# EAGLE design USBBreakout-ISO-3.2 (EAGLE 9.6.2)
Assembly variants: JLCPCB

## Sheet 1 of 3
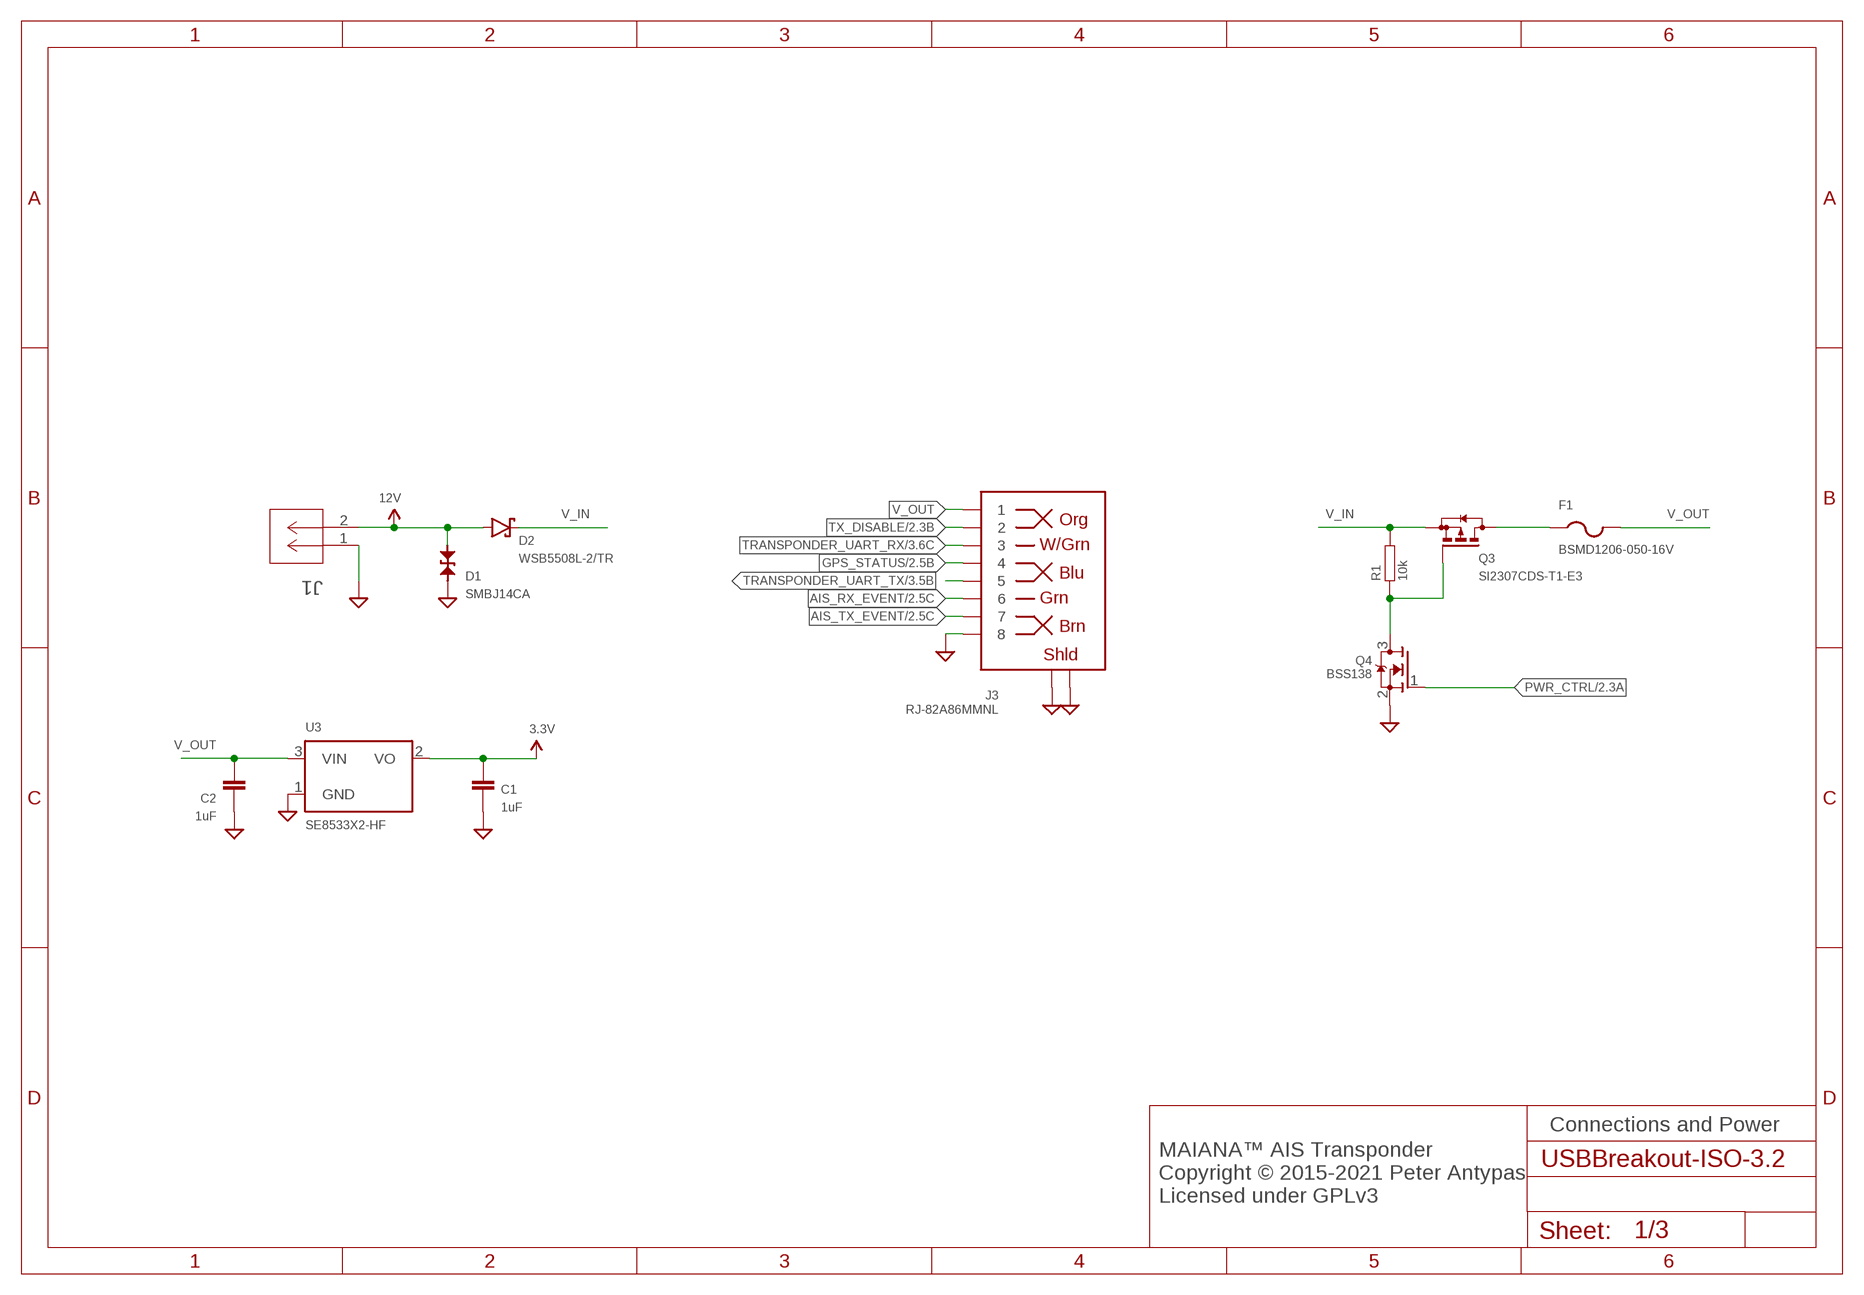
[diagram p0: schematic, sheet 1]

### Parts
C1  1uF  CAPACITOR0603  [0603]
C2  1uF  CAPACITOR0603  [0603]
D1  SMBJ14CA  DIODE-TVS-BIDIRSMB  [SMB-BIDIR]
D2  WSB5508L-2/TR  DIODE-SCHOTTKYSOD123  [SOD123]
F1  BSMD1206-050-16V  PTCFUSE-1206  [R1206]
J1  OSTVN02A150  [CONN_OSTVN02A150_OST]  (not fitted in variant JLCPCB)
J3  RJ-82A86MMNL  [RJ-82A86MMNL]
Q3  SI2307CDS-T1-E3  BSS84  [SOT23]
Q4  BSS138  MOSFET-NREFLOW  [SOT23]
R1  10k  RESISTOR0603  [0603]
U3  SE8533X2-HF  MCP1799T  [SOT23]

### Nets
3.3V: C1.P$1 U3.2(VO) ; also sheet 2,3
12V: D1.A D2.A J1.2
AIS_RX_EVENT: J3.P$6 ; also sheet 2
AIS_TX_EVENT: J3.P$7 ; also sheet 2
GND: C1.P$2 C2.P$2 D1.C J1.1 J3.P$8 J3.P$9(SHLD) J3.P$10(SHLD) J3.P$11(SHLD) J3.P$12(SHLD) Q4.2(S) U3.1(GND) ; also sheet 2,3
GPS_STATUS: J3.P$4 ; also sheet 2
N$8: Q3.1(G) Q4.3(D) R1.P$1
N$10: F1.1 Q3.3(D)
PWR_CTRL: Q4.1(G) ; also sheet 2
TRANSPONDER_UART_RX: J3.P$3 ; also sheet 3
TRANSPONDER_UART_TX: J3.P$5 ; also sheet 3
TX_DISABLE: J3.P$2 ; also sheet 2
V_IN: D2.C Q3.2(S) R1.P$2 ; also sheet 2
V_OUT: C2.P$1 F1.2 J3.P$1 U3.3(VIN)

### Notes on the sheet
- Connections and Power
- MAIANA™ AIS Transponder
  Copyright © 2015-2021 Peter Antypas
  Licensed under GPLv3

## Sheet 2 of 3
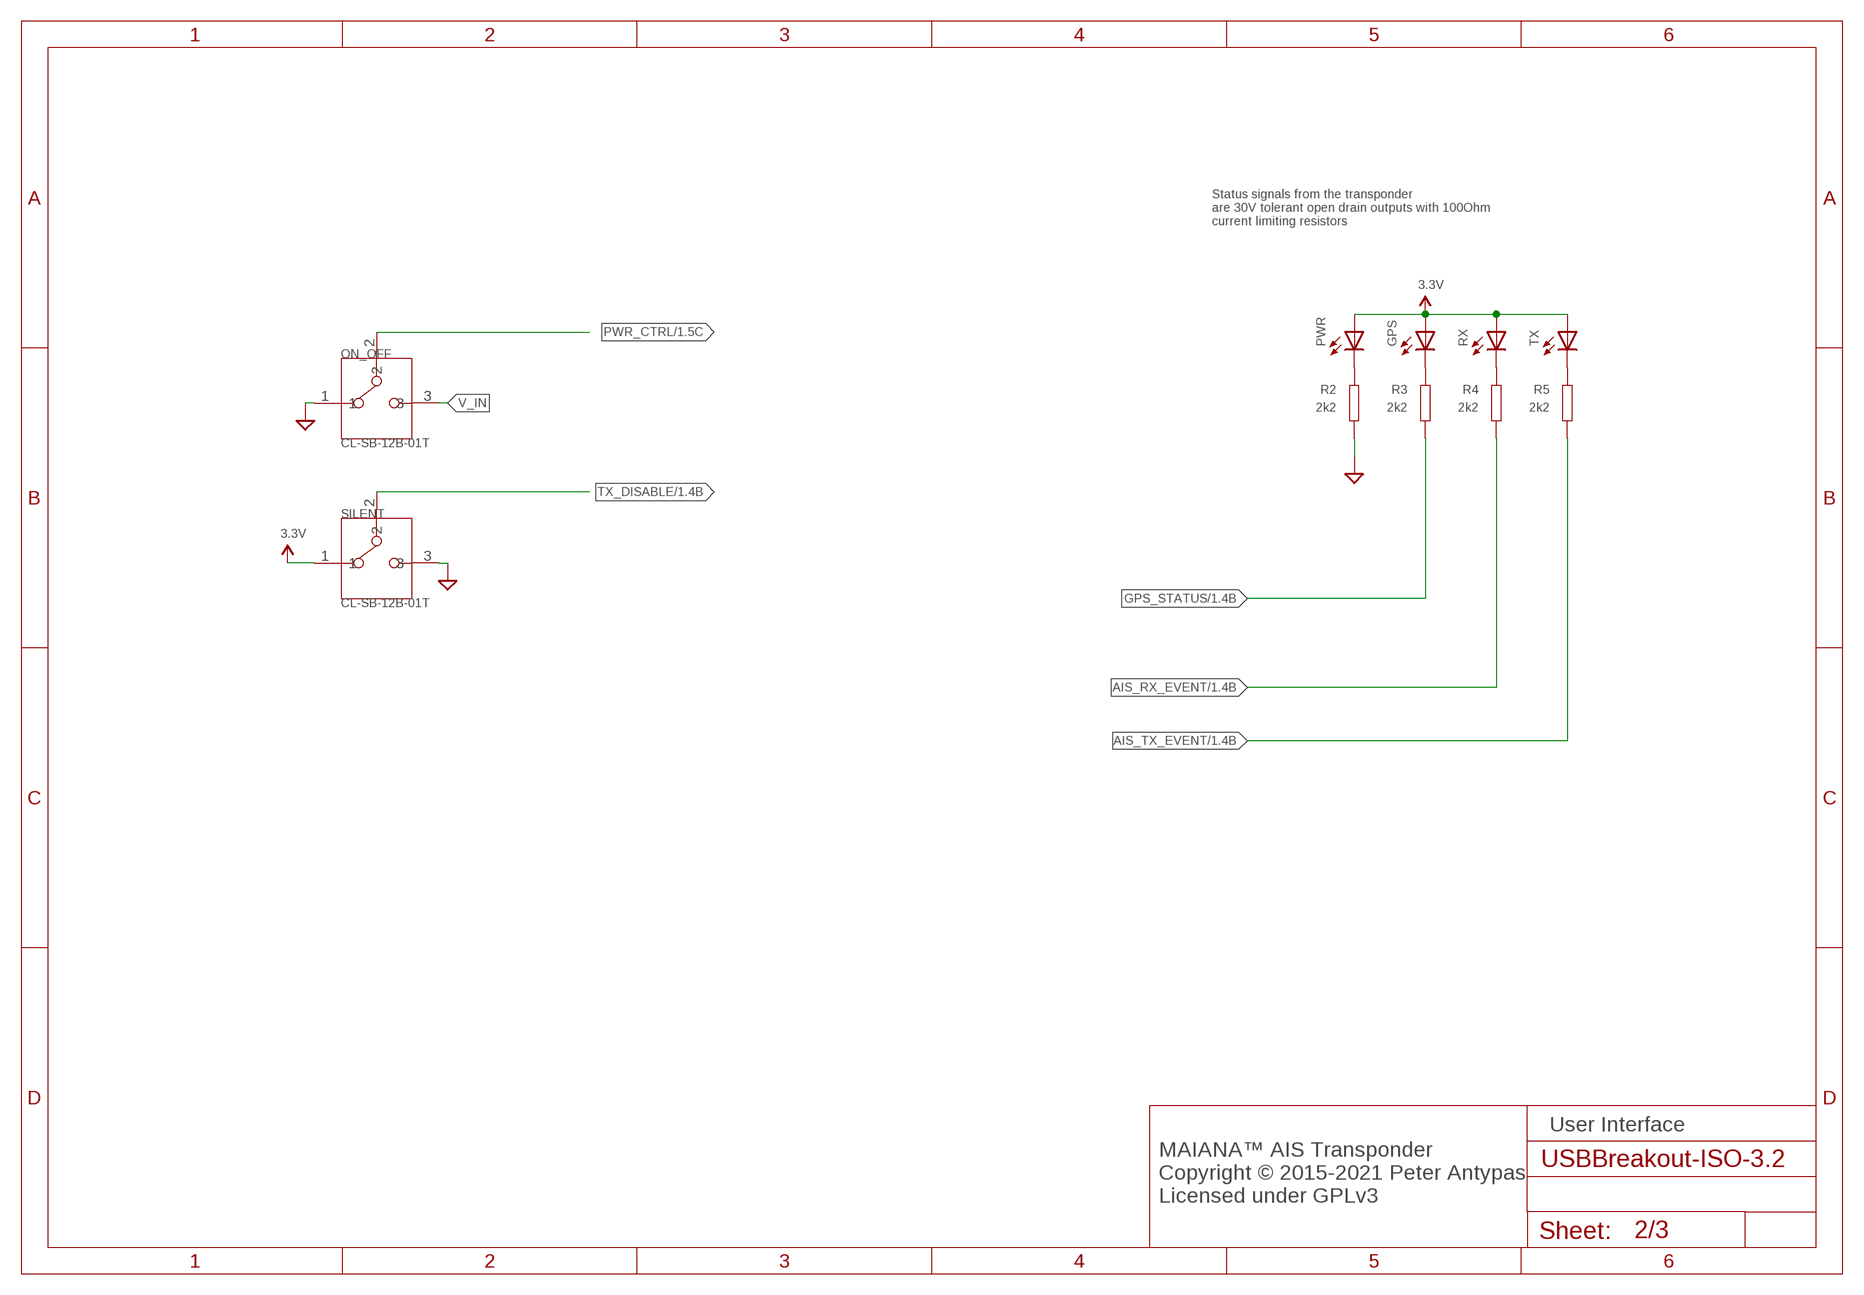
[diagram p1: schematic, sheet 2]

### Parts
GPS  LEDCHIPLED_1206  [CHIPLED_1206]
ON_OFF  CL-SB-12B-01T  [CL-SB-12B]
PWR  LEDCHIPLED_1206  [CHIPLED_1206]
R2  2k2  RESISTOR0603  [0603]
R3  2k2  RESISTOR0603  [0603]
R4  2k2  RESISTOR0603  [0603]
R5  2k2  RESISTOR0603  [0603]
RX  LEDCHIPLED_1206  [CHIPLED_1206]
SILENT  CL-SB-12B-01T  [CL-SB-12B]
TX  LEDCHIPLED_1206  [CHIPLED_1206]

### Nets
3.3V: GPS.A PWR.A RX.A SILENT.1 TX.A ; also sheet 1,3
AIS_RX_EVENT: R4.P$2 ; also sheet 1
AIS_TX_EVENT: R5.P$2 ; also sheet 1
GND: ON_OFF.1 R2.P$2 SILENT.3 ; also sheet 1,3
GPS_STATUS: R3.P$2 ; also sheet 1
N$2: PWR.C R2.P$1
N$3: GPS.C R3.P$1
N$4: R4.P$1 RX.C
N$5: R5.P$1 TX.C
PWR_CTRL: ON_OFF.2 ; also sheet 1
TX_DISABLE: SILENT.2 ; also sheet 1
V_IN: ON_OFF.3 ; also sheet 1

### Notes on the sheet
- Status signals from the transponder
  are 30V tolerant open drain outputs with 100Ohm 
  current limiting resistors
- User Interface
- MAIANA™ AIS Transponder
  Copyright © 2015-2021 Peter Antypas
  Licensed under GPLv3

## Sheet 3 of 3
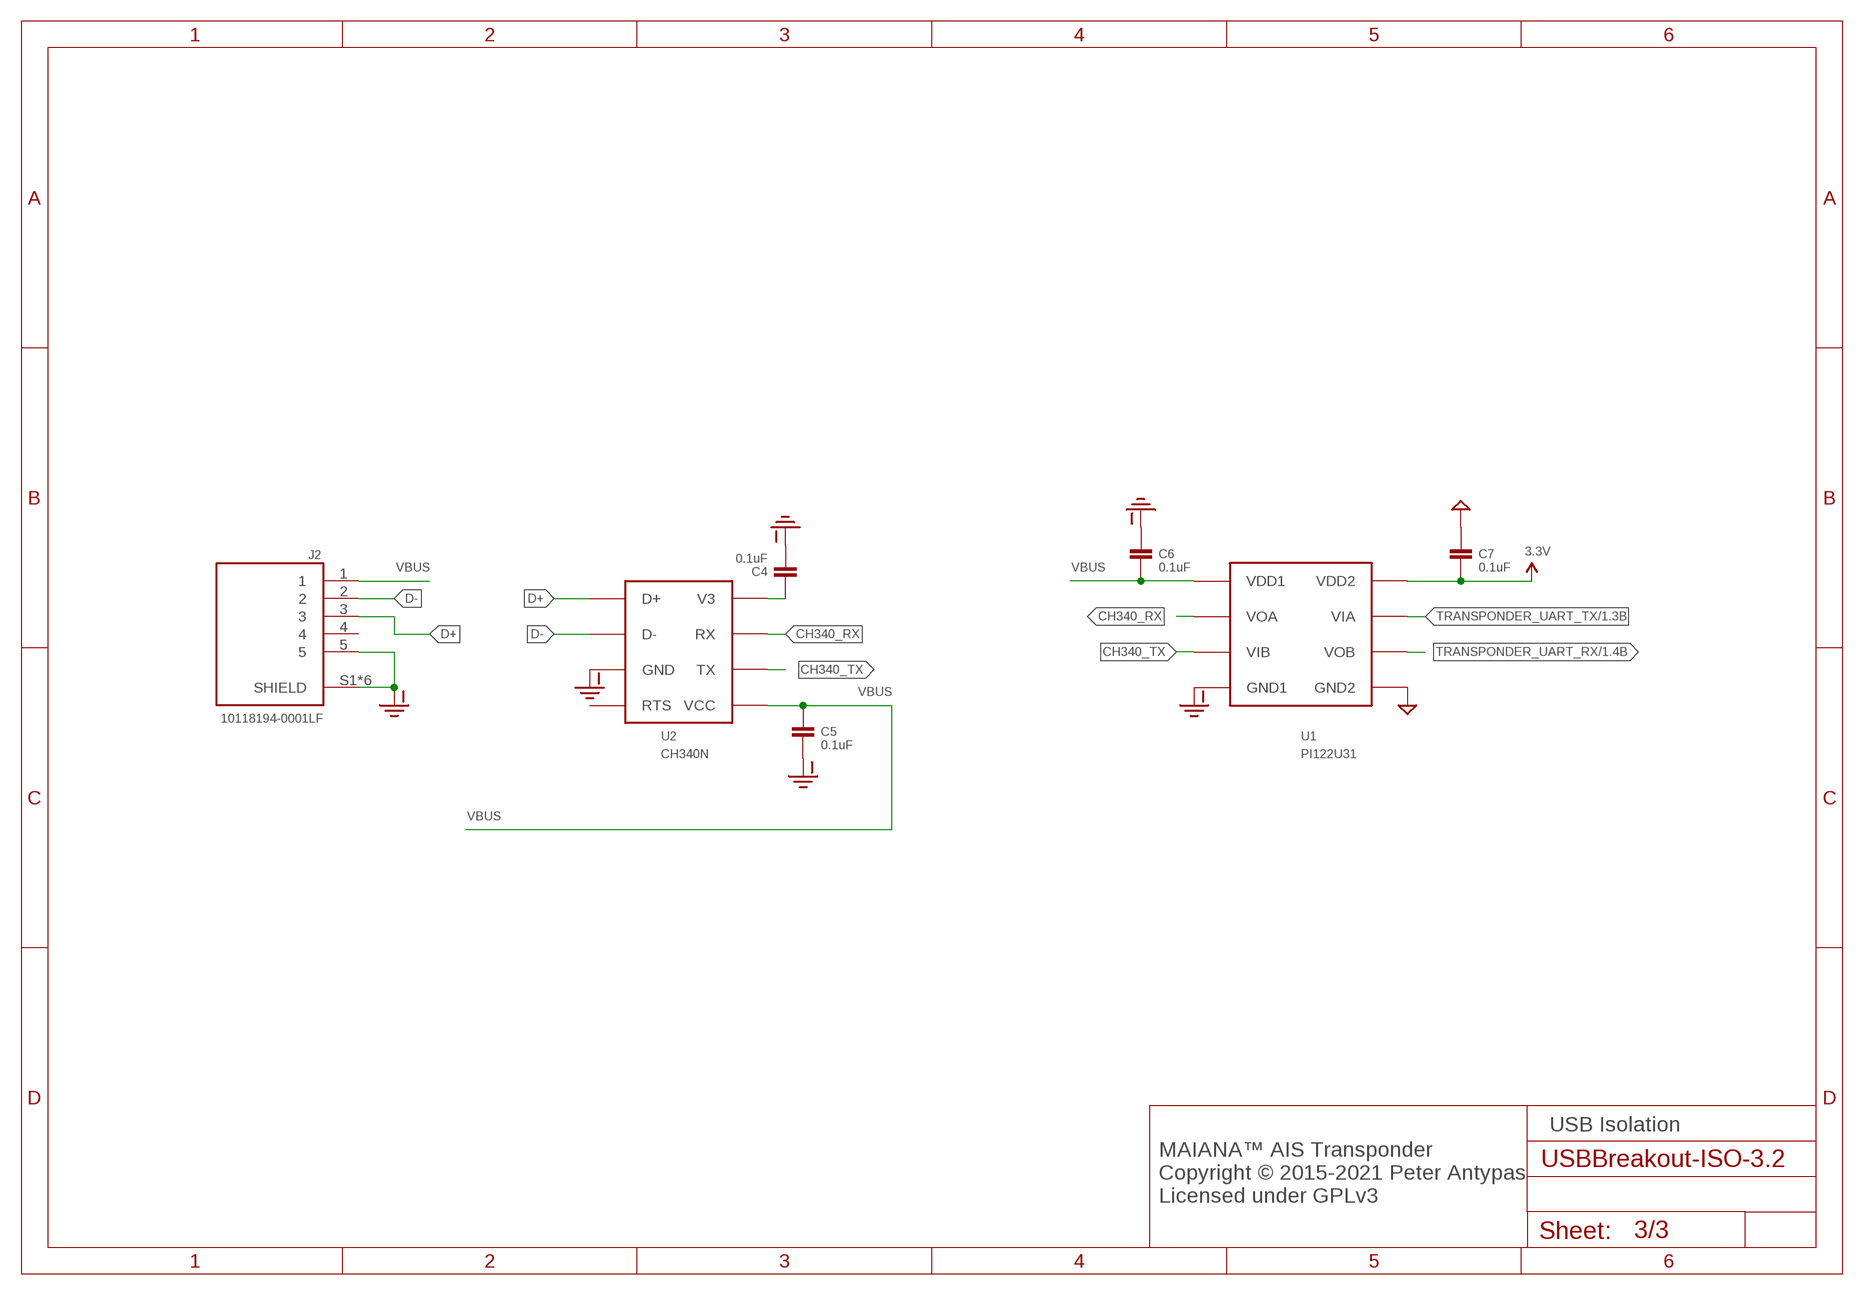
[diagram p2: schematic, sheet 3]

### Parts
C4  0.1uF  CAPACITOR0603  [0603]
C5  0.1uF  CAPACITOR0603  [0603]
C6  0.1uF  CAPACITOR0603  [0603]
C7  0.1uF  CAPACITOR0603  [0603]
J2  10118194-0001LF  [AMPHENOL_10118194-0001LF]
U1  PI122U31  PI122U3X  [SOIC8]
U2  CH340N  CH330N  [SOIC-8]

### Nets
3.3V: C7.P$2 U1.8(VDD2) ; also sheet 1,2
CH340_RX: U1.2(VOA) U2.7(RX)
CH340_TX: U1.3(VIB) U2.6(TX)
D+: J2.3 U2.1(D+)
D-: J2.2 U2.2(D-)
GND: C7.P$1 U1.5(GND2) ; also sheet 1,2
GND-ISO: C4.P$2 C5.P$2 C6.P$1 J2.5 J2.S1(SHIELD) J2.S2(SHIELD) J2.S3(SHIELD) J2.S4(SHIELD) J2.S5(SHIELD) J2.S6(SHIELD) U1.4(GND1) U2.3(GND)
N$1: C4.P$1 U2.8(V3)
TRANSPONDER_UART_RX: U1.6(VOB) ; also sheet 1
TRANSPONDER_UART_TX: U1.7(VIA) ; also sheet 1
VBUS: C5.P$1 C6.P$2 J2.1 U1.1(VDD1) U2.5(VCC)
Unconnected: J2.4 U2.4(RTS)

### Notes on the sheet
- USB Isolation
- MAIANA™ AIS Transponder
  Copyright © 2015-2021 Peter Antypas
  Licensed under GPLv3

## Library data of the parts
C1 C2 = MyPassives:CAPACITOR: Standard SMD capacitor; PARTNO: CC0603KRX5R8BB105
C4-C7 = MyPassives:CAPACITOR: Standard SMD capacitor; PARTNO: 06035C104KAT2A
D1 = MyDiodes:DIODE-TVS-BIDIR: Bidirectional TVS diode; PARTNO: SMBJ14CA
D2 = MyDiodes:DIODE-SCHOTTKY: Standard SMD Schottky diode; PARTNO: WSB5508L-2/TR
F1 = adafruit:PTCFUSE: PTC fuses, resettable thermistors; PARTNO: BSMD1206-050-16V
GPS PWR RX TX = led:LED: LED OSRAM: - CHIPLED LG R971, LG N971, LY N971, LG Q971, LY Q971, LO R971, LY R971 LH N974, LH R974 LS Q976, LO Q976, LY Q976 LO Q996 - Hyper CHIPLED LW Q18S LB Q993, LB Q99A, LB R99A - SideLED LS A670, LO A670, LY A670, LG A670, LP A670 LB A673, LV A673, LT A673, LW A673 LH A674 LY A675 LS A676, LA A676, LO A676, LY A676, LW A676 LS A679, LY A679, LG A679 - Hyper Micro SIDELED® LS Y876, LA Y876, LO Y876, LY Y876 LT Y87S - SmartLED LW L88C, LW L88S LB L89C, LB L89S, LG L890 LS L89K, LO L89K, LY L89K LS L896, LA L896, LO L896, LY L896 - TOPLED LS T670, LO T670, LY T670, LG T670, LP T670 LSG T670, LSP T670, LSY T670, LOP T670, LYG T670 LG T671, LOG T671, LSG T671 LB T673, LV T673, LT T673, LW T673 LH T674 LS T676, LA T676, LO T676, LY T676, LB T676, LH T676, LSB T676, LW T676 LB T67C, LV T67C, LT T67C, LS T67K, LO T67K, LY T67K, LW E67C LS E67B, LA E67B, LO E67B, LY E67B, LB E67C, LV E67C, LT E67C LW T67C LS T679, LY T679, LG T679 LS T770, LO T770, LY T770, LG T770, LP T770 LB T773, LV T773, LT T773, LW T773 LH T774 LS E675, LA E675, LY E675, LS T675 LS T776, LA T776, LO T776, LY T776, LB T776 LHGB T686 LT T68C, LB T68C - Hyper Mini TOPLED® LB M676 - Mini TOPLED Santana® LG M470 LS M47K, LO M47K, LY M47K Source: http://www.osram.convergy.de LUXEON: - LUMILED® LXK2-PW12-R00, LXK2-PW12-S00, LXK2-PW14-U00, LXK2-PW14-V00 LXK2-PM12-R00, LXK2-PM12-S00, LXK2-PM14-U00 LXK2-PE12-Q00, LXK2-PE12-R00, LXK2-PE12-S00, LXK2-PE14-T00, LXK2-PE14-U00 LXK2-PB12-K00, LXK2-PB12-L00, LXK2-PB12-M00, LXK2-PB14-N00, LXK2-PB14-P00, LXK2-PB14-Q00 LXK2-PR12-L00, LXK2-PR12-M00, LXK2-PR14-Q00, LXK2-PR14-R00 LXK2-PD12-Q00, LXK2-PD12-R00, LXK2-PD12-S00 LXK2-PH12-R00, LXK2-PH12-S00 LXK2-PL12-P00, LXK2-PL12-Q00, LXK2-PL12-R00 Source: www.luxeon.com KINGBRIGHT: KA-3528ASYC Source: www.kingbright.com; PARTNO: TJ-S3216CL9T5ALC2G-A5
J1 = ost-2pin-contact:OSTVN02A150; BUILT_BY: EMA_Cory; COPYRIGHT: Copyright (C) 2018 Accelerated Designs. All rights reserved; MANUFACTURER_PART_NUMBER: OSTVN02A150; PARTNO: OSTVN02A150; SOURCELIBRARY: On_Shore_Technology_2019-12-02; VENDOR: On Shore Technology Inc
J2 = 10118194-0001LF:10118194-0001LF: Micro Usb, 2.0 Type b, Rcpt, Smt Check prices <https://snapeda.com/parts/10118194-0001LF/Amphenol%20ICC%20%28FCI%29/view-part/?ref=eda>; ARROW_ELECTRONICS-PURCHASE-URL: https://snapeda.com/shop?store=Arrow+Electronics&id=4816633; AVAILABILITY: Good; DESCRIPTION: USB - micro B USB 2.0 Receptacle Connector 5 Position Surface Mount, Right Angle; Through Hole; DIGIKEY-PURCHASE-URL: https://snapeda.com/shop?store=DigiKey&id=4816633; MF: Amphenol ICC (FCI); MOUSER-PURCHASE-URL: https://snapeda.com/shop?store=Mouser&id=4816633; MP: 10118194-0001LF; PACKAGE: None; PARTNO: 10118194-0001LF; PRICE: None
J3 = xyfw:RJ-82A86MMNL: Mid-mount RJ45 jack; PARTNO: RJ-82A86MMNL
ON_OFF SILENT = CL-SB-12B-01T:CL-SB-12B-01T: Check prices <https://pricing.snapeda.com/parts/CL-SB-12B-01T/Nidec%20Copal/view-part?ref=eda>; AVAILABILITY: In Stock; DESCRIPTION: Slide Switch SPDT Surface Mount; MF: Nidec Copal; MP: CL-SB-12B-01T; PACKAGE: None; PARTNO: CL-SB-12B-01T; PRICE: None
Q3 = transistor-small-signal:BSS84: P-CHANNEL MOS FET; PARTNO: SI2307CDS-T1-E3
Q4 = adafruit:MOSFET-N: N-Channel Mosfet 2N7002E - 60V 260mA SOT23 [Digikey: 2N7002ET1GOSTR-ND] - REEL BSH103 - 30V 850mA SOT23 [Digikey: 568-5013-1-ND]; PARTNO: BSS138
R1 = MyPassives:RESISTOR: Standard SMD resistor; PARTNO: RC0603FR-0710KL
R2-R5 = MyPassives:RESISTOR: Standard SMD resistor; PARTNO: CR0603-FX-2201ELF
U1 = 2paisemi:PI122U3X: 2 Channel Capacitive Divider Isolator; PARTNO: Pi122U31
U2 = JiangsuQinHeng:CH330N: USB to UART bridge; PARTNO: CH340N
U3 = microchip:MCP1799T: 80mA High Voltage Automotive LDO; PARTNO: SE8533X2-HF; VALUE: MCP1799T

## Board
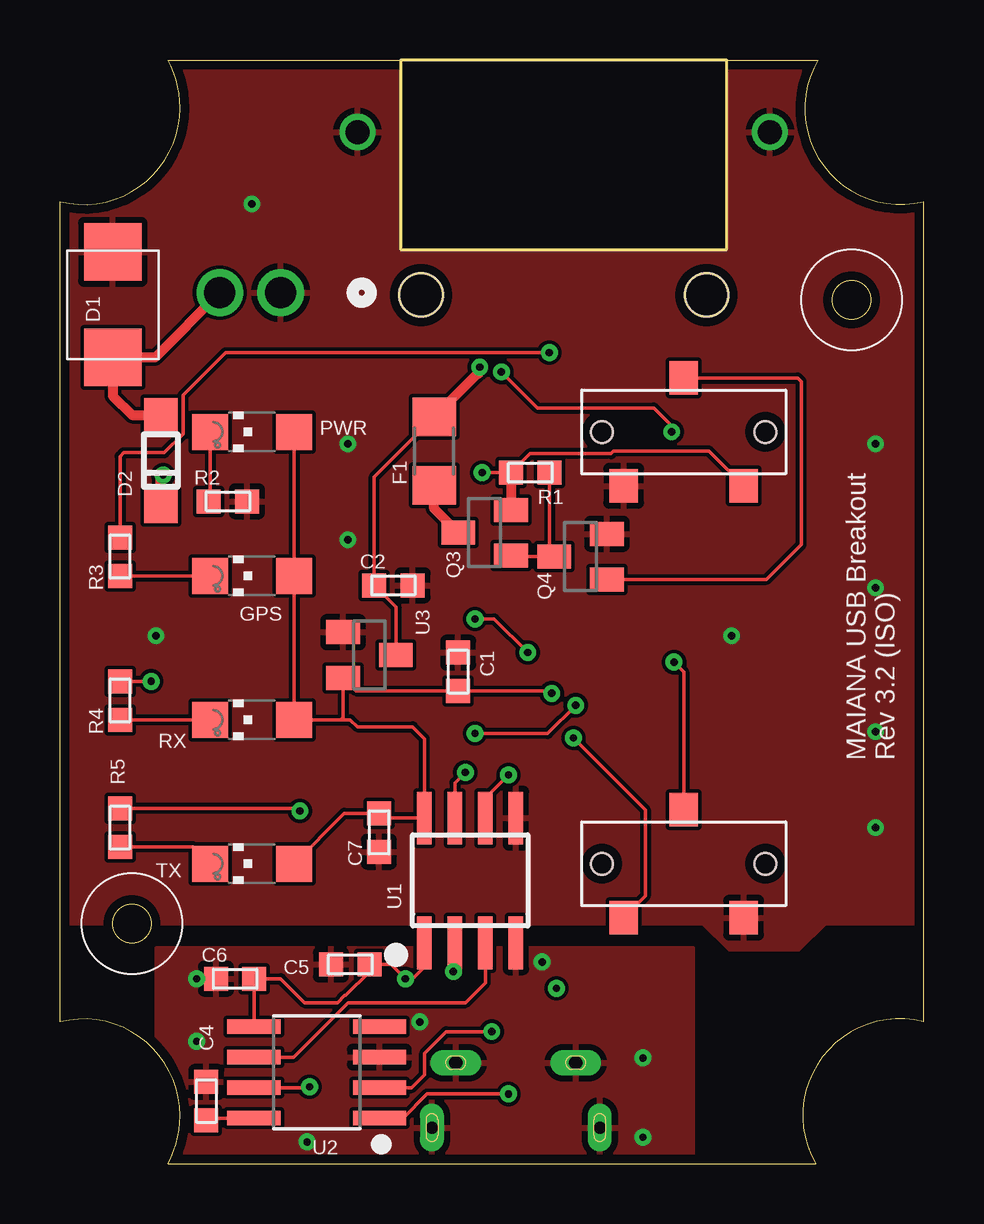
[diagram p3: board, top side]
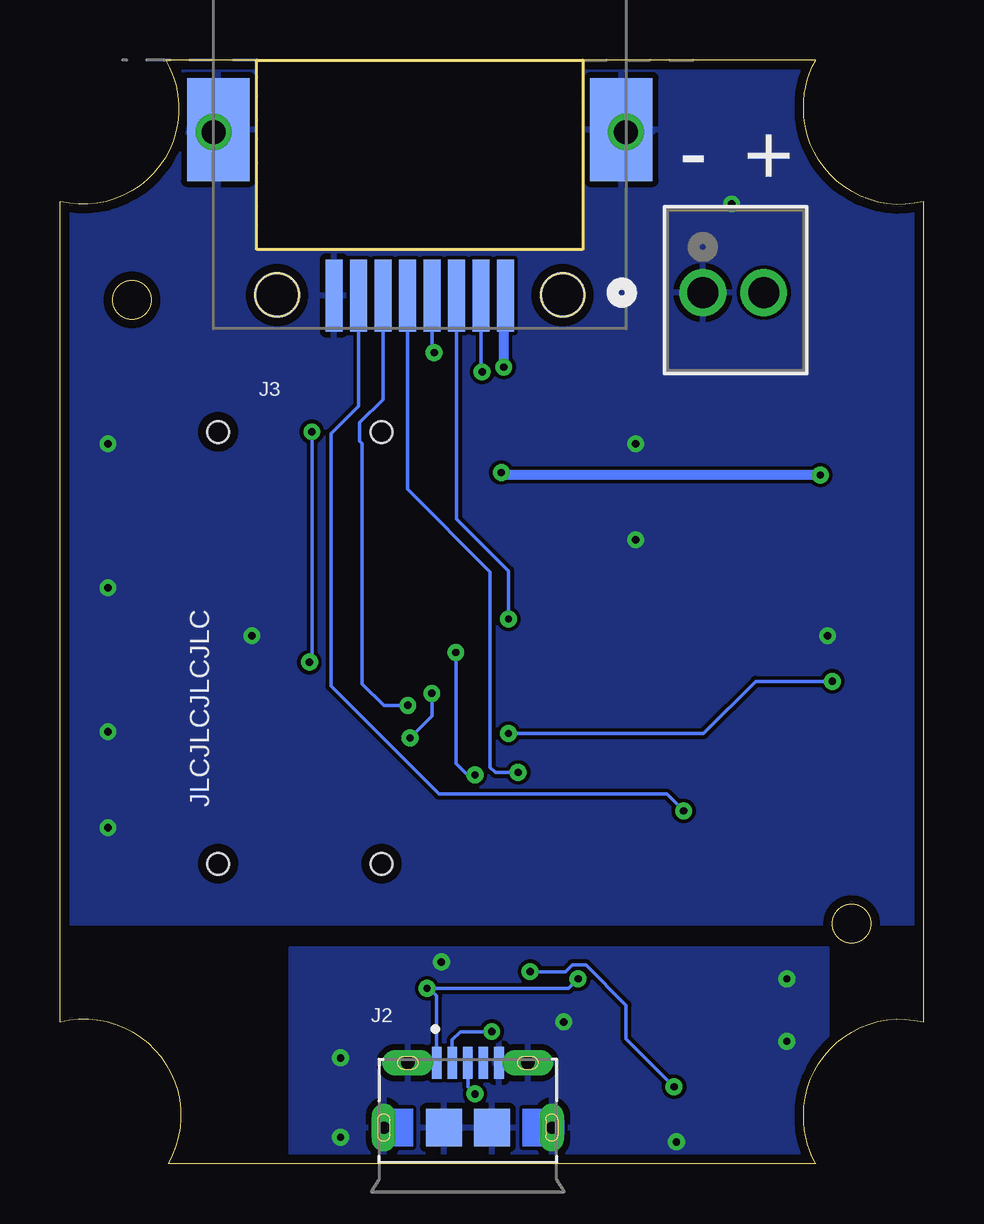
[diagram p4: board, bottom side, seen from below]

Size 36 x 46 mm. Coordinates in mm from the lower left corner, seen from the top.
Outline: 5,2 arc104 0,5.9
Outline: 0,40.1 arc104 5,44
Outline: 4.5,0 arc30 5,2
Outline: 5,44 arc30 4.5,46
Outline: 0,40.1 arc104 5,44
Outline: 0,40.1 arc104 5,44
Outline: 0,5.9 0,40.1
Outline: 5,2 arc104 0,5.9
Outline: 0,40.1 arc104 5,44
Outline: 4.5,0 arc30 5,2
Outline: 5,44 arc30 4.5,46
Outline: 5,2 arc104 0,5.9
Outline: 5,2 arc104 0,5.9
Outline: 4.5,0 arc30 5,2
Outline: 4.5,0 arc30 5,2
Outline: 5,44 arc30 4.5,46
Outline: 5,44 arc30 4.5,46
Outline: 4.5,0 31.5,0 arc-134 36,5.9 36,40.1 arc-134 31.6,46 4.5,46
Outline: circle at 3,10 radius 0.8
Outline: circle at 3,10 radius 0.8
Outline: circle at 3,10 radius 0.8
Outline: circle at 3,10 radius 0.8
Outline: circle at 33,36 radius 0.8
Copper layers (1*16): Top 0.035mm / dielectric 1.5mm / Bottom 0.035mm
Design rules "default *": minimum track width 6mil, minimum drill 0.3mm, track to track 6mil, track to pad 6mil, pad to pad 6mil, via to via 6mil, smd to smd 0mil, copper to edge 15mil, drill to drill 6mil, minimum pad ring 10mil, minimum via ring 8mil, stop-mask expansion 1mil, vias tented up to drill 20mil, thermal gap 10mil

### Footprints (pad centres in the part's own frame; a part is rotated, then mirrored left to right if it is on the bottom)
0603 = smd 1 x 1: P$1 -0.8,0; P$2 0.8,0
SMB-BIDIR = smd 2.4 x 2.4: A 2.2,0; C -2.2,0
SOD123 = smd 1.4 x 1.4: A 1.9,0; C -1.9,0
R1206 = smd 1.6 x 1.803: 1 -1.422,0; 2 1.422,0
CHIPLED_1206 = smd 1.5 x 1.5: A 0,-1.75; C 0,1.75
CONN_OSTVN02A150_OST = drill 1.295 pad 1.803: 1 0,0; 2 2.54,0
AMPHENOL_10118194-0001LF = smd 0.4 x 1.35: 1 -1.3,2.7; 2 -0.65,2.7; 3 0,2.7; 4 0.65,2.7; 5 1.3,2.7 | drill 0.55 pad 0.65 long: S1 -2.5,2.7; S2 2.5,2.7 | drill 0.5 pad 0.775 long: S3 -3.5,0; S6 3.5,0 | smd 1.5 x 1.55: S4 -1,0; S5 1,0
RJ-82A86MMNL = smd 0.7 x 3: P$1 -3.57,3.82; P$2 -2.55,3.82; P$3 -1.53,3.82; P$4 -0.51,3.82; P$5 0.51,3.82; P$6 1.53,3.82; P$7 2.55,3.82; P$8 3.57,3.82 | smd 2.6 x 4.3: P$9 -8.4,-3.1; P$10 8.4,-3.1 | drill 1: P$11 -8.6,-3; P$12 8.6,-3 | hole 1.8: -5.95,3.8; 5.95,3.8
CL-SB-12B = smd 1.2 x 1.4: 1 -2.5,-2.25; 2 0,2.25; 3 2.5,-2.25 | hole 0.9: 3.4,0; -3.4,0
SOT23 = smd 1 x 1.4: 1 -0.95,-1.1; 2 0.95,-1.1; 3 0,1.1
SOIC8 = smd 0.6 x 2.2: 1 -1.905,-2.6; 2 -0.635,-2.6; 3 0.635,-2.6; 4 1.905,-2.6; 5 1.905,2.6; 6 0.635,2.6; 7 -0.635,2.6; 8 -1.905,2.6
SOIC-8 = smd 2.21 x 0.61: 1 -2.616,1.905; 2 -2.616,0.635; 3 -2.616,-0.635; 4 -2.616,-1.905; 5 2.616,-1.905; 6 2.616,-0.635; 7 2.616,0.635; 8 2.616,1.905

### Placement (x,y rotation side)
C1  16.6,20.5 90 top
C2  13.9,24.1 0 top
C4  6.1,2.6 90 top
C5  12.1,8.3 180 top
C6  7.3,7.7 0 top
C7  13.3,13.8 90 top
D1  2.2,35.8 270 top
D2  4.2,29.3 90 top
F1  15.6,29.7 90 top
GPS  8,24.5 90 top
J1  9.2,36.3 0 bottom
J2  19,1.5 0 bottom
J3  21,40 180 bottom
ON_OFF  26,30.5 0 top
PWR  8,30.5 90 top
Q3  17.7,26.3 90 top
Q4  21.7,25.3 90 top
R1  19.6,28.8 180 top
R2  7,27.6 0 top
R3  2.5,25.3 90 top
R4  2.5,19.3 90 top
R5  2.5,14 90 top
RX  8,18.5 90 top
SILENT  26,12.5 0 top
TX  8,12.5 90 top
U1  17.1,11.8 0 top
U2  10.7,3.8 180 top
U3  12.9,21.2 270 top

### Tracks (layer width: path | path; a pad name or v marks a point on that pad's centre or on a via)
3.3V  (via drill 0.3)
  Top 0.152: 11.7,18.5 RX.A GPS.A PWR.A | 11.7,18.5 12.1,18.5 12.4,18.2 14.7,18.2 15.2,17.7 U1.8 13.5,14.4 C7.P$2 11.85,14.6 TX.A | v21.41,17.74 24.4,14.75 24.4,11.15 SILENT.1 | v20.5,19.6 20.4,19.7 C1.P$1 12.35,19.7 U3.2 11.8,18.6 11.7,18.5
  Bottom 0.152: v20.5,19.6 20.5,18.65 v21.41,17.74
12V
  Top 0.406: J1.2 3.96,33.6 D1.A 2.2,32 3,31.2 D2.A
AIS_RX_EVENT  (via drill 0.3)
  Top 0.152: v21.5,19.1 20.33,17.93 v17.3,17.93 | v3.8,20.1 R4.P$2
  Bottom 0.152: J3.P$6 22.53,31.85 23.51,30.88 23.51,30.12 23.4,30.02 23.4,20 22.5,19.1 v21.5,19.1 | v17.3,17.93 9.17,17.93 7,20.1 v3.8,20.1
AIS_TX_EVENT  (via drill 0.3)
  Top 0.152: v10,14.7 9.9,14.8 R5.P$2
  Bottom 0.152: J3.P$7 23.55,31.58 24.7,30.43 24.7,19.9 20.2,15.4 10.7,15.4 v10,14.7
CH340_RX  (via drill 0.3)
  Top 0.152: U2.7 10.37,3.17 v10.4,3.2 | v16.4,8 16.4,9.13 U1.2
  Bottom 0.152: v10.4,3.2 12.4,5.2 12.4,6.6 14.08,8.28 14.64,8.28 14.92,8 v16.4,8
CH340_TX
  Top 0.152: U2.6 9.73,4.43 12,6.7 16.9,6.7 17.73,7.54 U1.3
D+  (via drill 0.3)
  Top 0.152: U2.1 14.29,1.9 15.3,2.9 v18.7,2.9
  Bottom 0.152: v18.7,2.9 19,3.2 J2.3
D-  (via drill 0.3)
  Top 0.152: U2.2 14.66,3.17 15.2,3.7 15.2,4.6 16.1,5.5 v18,5.5
  Bottom 0.152: v18,5.5 19.3,5.5 19.65,5.15 J2.2
GND  (via drill 0.3)
  other vias: 34,14 34,18 34,24 34,30 28,22 8,40 12,30 12,26 4,22
  pour Top: -1,47 37,47 37,10 31.9,10 30.8,8.9 27.9,8.9 26.8,10 -1,10
  pour Bottom: -1.4,47.3 37.4,47.3 37.4,10 -1.4,10
GND-ISO  (via drill 0.3)
  other vias: 24.3,4.4 5.7,7.7 10.3,0.9 24.3,1.1 20.1,8.4 15,5.9 5.7,5.1
  pour Top: 4,9 26.4,9 26.4,-0.5 4,-0.5
  pour Bottom: 4,9 26.4,9 26.4,-0.5 4,-0.5
GPS_STATUS  (via drill 0.3)
  Top 0.152: v20.4,33.8 6.9,33.8 5.13,32.03 5.13,30.41 4.35,29.63 2.65,29.63 2.5,29.47 R3.P$2
  Bottom 0.152: J3.P$4 20.49,33.91 20.5,33.9 v20.4,33.8
N$1
  Top 0.152: U2.8 6.2,1.9 C4.P$1
N$2
  Top 0.152: PWR.C 6.25,27.65 R2.P$1
N$3
  Top 0.152: R3.P$1 GPS.C
N$4
  Top 0.152: RX.C R4.P$1
N$5
  Top 0.152: R5.P$1 5.55,13.2 TX.C
N$8
  Top 0.152: R1.P$1 20.4,25.5 Q4.3 18.85,25.3 Q3.1
N$10
  Top 0.406: Q3.3 15.6,27.3 F1.1
PWR_CTRL
  Top 0.152: ON_OFF.2 30.75,32.75 30.9,32.6 30.9,25.8 29.45,24.35 Q4.1
TRANSPONDER_UART_RX  (via drill 0.3)
  Top 0.152: v17.3,22.7 18.1,22.7 v19.5,21.3 | v18.7,16.2 17.73,15.23 U1.6
  Bottom 0.152: J3.P$3 19.47,26.87 17.3,24.7 v17.3,22.7 | v19.5,21.3 19.5,16.68 19.02,16.2 v18.7,16.2
TRANSPONDER_UART_TX  (via drill 0.3)
  Top 0.152: v16.9,16.3 16.46,15.87 U1.7
  Bottom 0.152: J3.P$5 21.51,28.11 18.07,24.66 18.07,16.52 17.85,16.3 v16.9,16.3
TX_DISABLE  (via drill 0.3)
  Top 0.152: v18.4,33 19.9,31.5 24.75,31.5 25.5,30.75 v25.5,30.5 | v25.6,20.9 26,20.5 SILENT.2
  Bottom 0.152: J3.P$2 18.45,33.05 v18.4,33 | v25.5,30.5 25.5,20.9 v25.6,20.9
V_IN  (via drill 0.3)
  Top 0.152: ON_OFF.3 27.05,29.7 23.08,29.7 22.98,29.59 19.59,29.59 R1.P$2 v17.6,28.8
  Top 0.406: R1.P$2 Q3.2 | D2.C 4.2,28.6 v4.3,28.7
  Bottom 0.406: v4.3,28.7 17.5,28.7 v17.6,28.8
V_OUT  (via drill 0.3)
  Top 0.152: F1.2 13.1,28.62 C2.P$1 14,23.2 U3.3
  Top 0.406: F1.2 17.38,32.9 17.4,32.9 17.5,33 v17.5,33.2
  Bottom 0.406: v17.5,33.2 17.5,36.11 J3.P$1
VBUS  (via drill 0.3)
  Top 0.152: U1.1 15.2,8.2 14.7,7.7 v14.4,7.7 13.8,8.3 C5.P$1 12.9,8 11.9,7 11.87,7 11.57,6.7 10.2,6.7 9.2,7.7 C6.P$2 8.08,7.68 U2.5
  Bottom 0.152: v20.7,7.3 20.6,7.3 | 20.6,7.3 14.8,7.3 v14.4,7.7 | 20.6,7.3 20.3,7 J2.1

### Text on the board
tNames: MAIANA USB Breakout / Rev 3.2 (ISO)
bNames: + | - | JLCJLCJLCJLC